# EAGLE design WifeOLED-v2 (EAGLE 6.5.0)
CNAME: An ESP8266 powered OLED display; CREVISION: v2; DESIGNER: Johan Kanflo
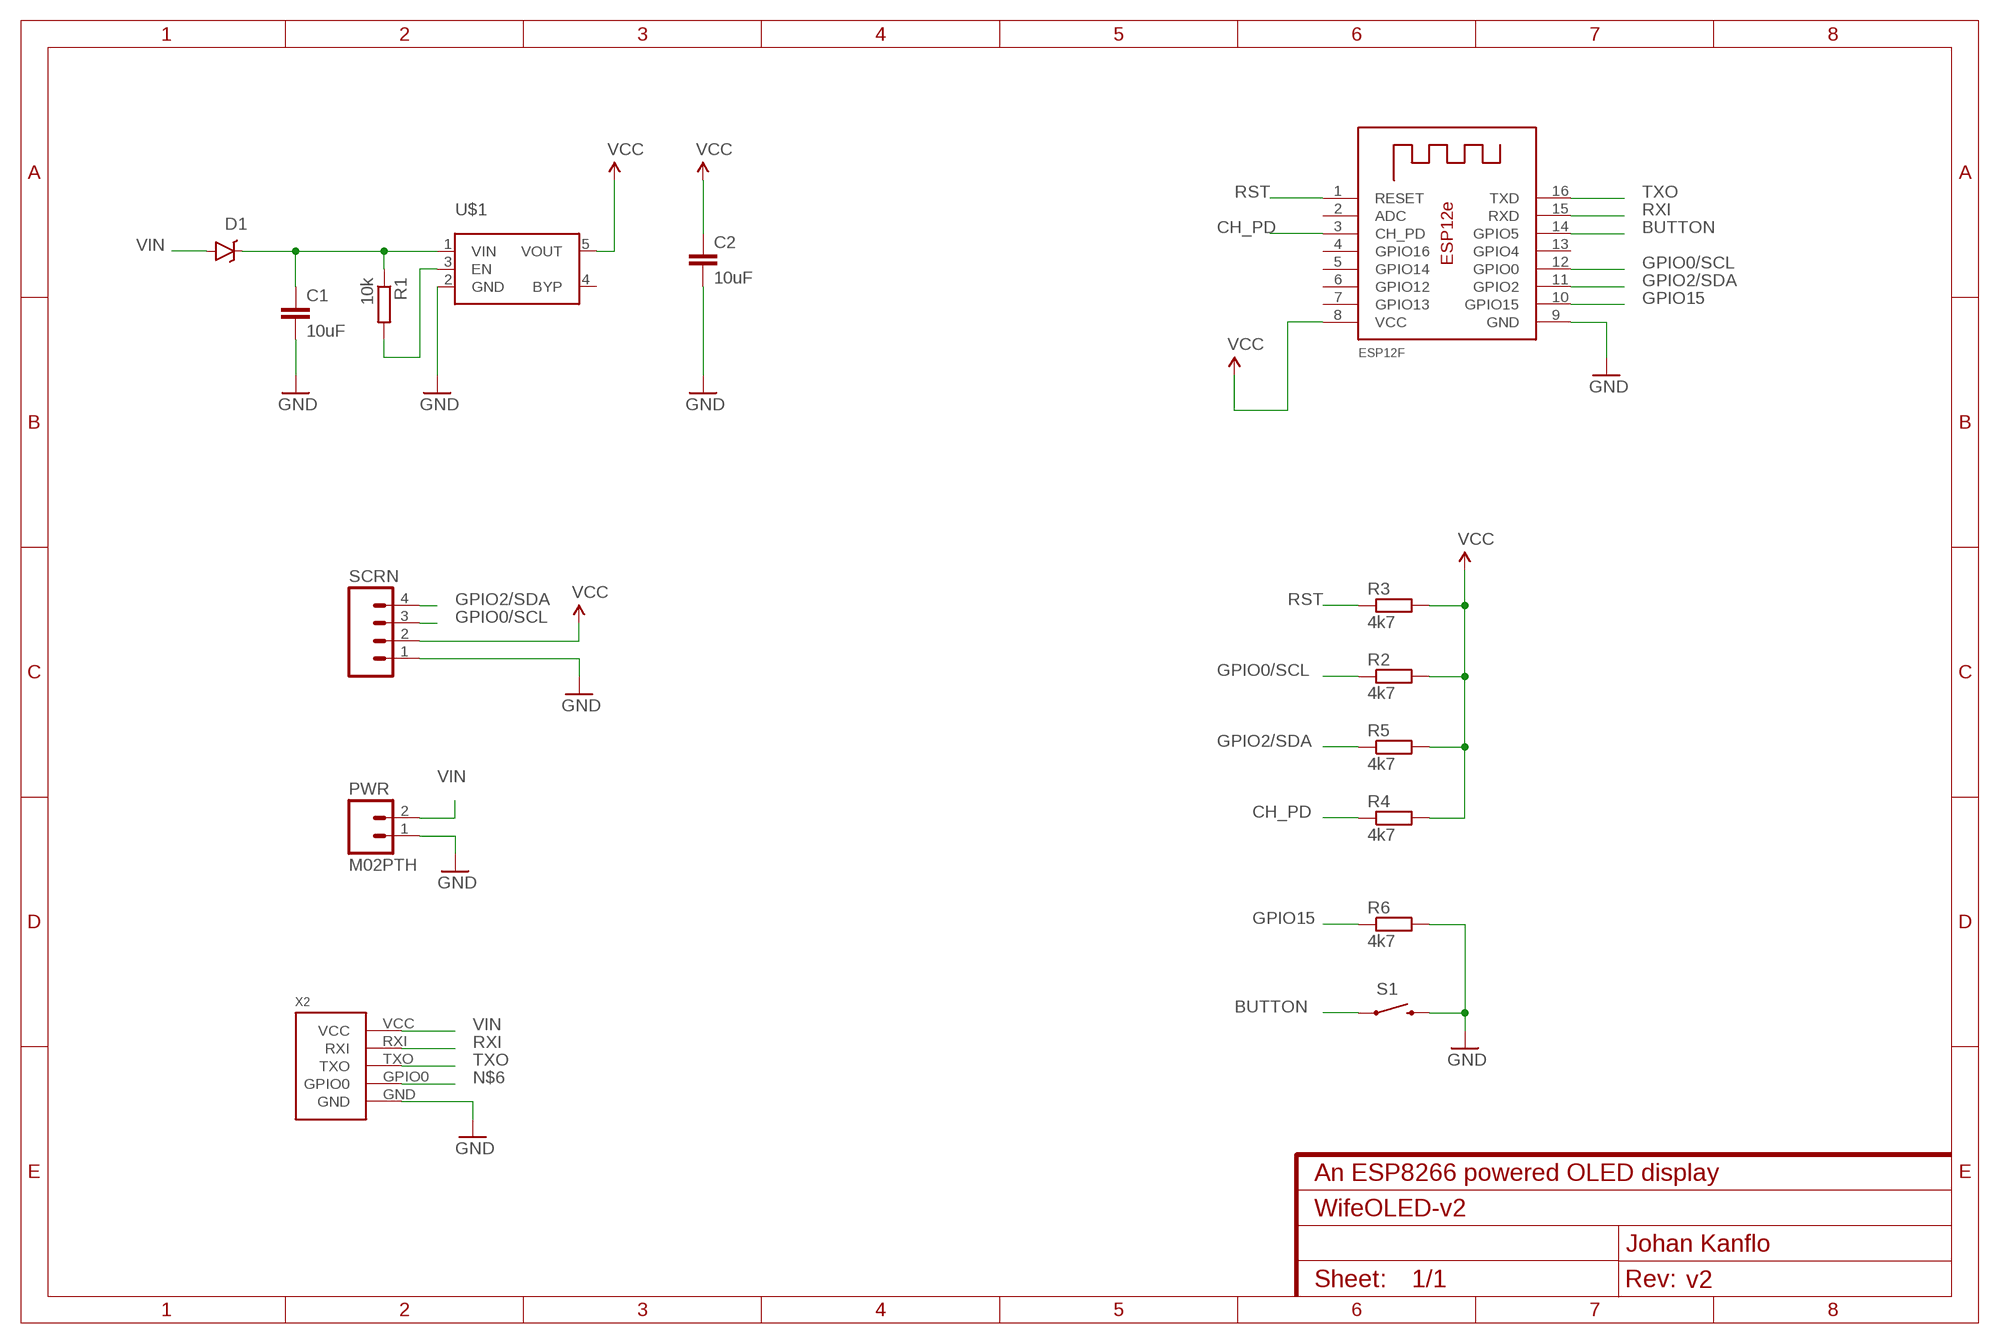
[diagram p0: schematic, sheet 1]

## Parts
C1  10uF  10UF-6.3V-20%(0603)  [0603-CAP]
C2  10uF  10UF-6.3V-20%(0603)  [0603-CAP]
D1  DIODE-SCHOTTKYSOD-123FL  [SOD-123FL]
ESP12F  ESP-12E  [ESP-12E]
PWR  M02PTH  [1X02]
R1  10k  R-EU_R0603  [R0603]
R2  4k7  R-EU_R0603  [R0603]
R3  4k7  R-EU_R0603  [R0603]
R4  4k7  R-EU_R0603  [R0603]
R5  4k7  R-EU_R0603  [R0603]
R6  4k7  R-EU_R0603  [R0603]
S1  SWITCH-MOMENTARY-2SMD-1101NE  [TACTILE-SWITCH-1101NE]
SCRN  M04PTH  [1X04]
U$1  SPX3819  [SOT23-5]
X2  ESPROGESPROG-DEVICE  [ESPROG]

## Nets
BUTTON: ESP12F.14(GPIO5) S1.1
CH_PD: ESP12F.3(CH_PD) R4.1
GND: C1.2 C2.2 ESP12F.9(GND) PWR.1 R6.2 S1.2 SCRN.1 U$1.2(GND) X2.GND
GPIO0/SCL: ESP12F.12(GPIO0) R2.1 SCRN.3
GPIO2/SDA: ESP12F.11(GPIO2) R5.1 SCRN.4
GPIO15: ESP12F.10(GPIO15) R6.1
N$1: R1.2 U$1.3(EN)
N$3: C1.1 D1.C R1.1 U$1.1(VIN)
N$6: X2.GPIO0
RST: ESP12F.1(RESET) R3.1
RXI: ESP12F.15(RXD) X2.RXI
TXO: ESP12F.16(TXD) X2.TXO
VCC: C2.1 ESP12F.8(VCC) R2.2 R3.2 R4.2 R5.2 SCRN.2 U$1.5(VOUT)
VIN: D1.A PWR.2 X2.VCC
Unconnected: ESP12F.2(ADC) ESP12F.4(GPIO16) ESP12F.5(GPIO14) ESP12F.6(GPIO12) ESP12F.7(GPIO13) ESP12F.13(GPIO4) U$1.4(BYP)

## Library data of the parts
C1 C2 = SparkFun-Capacitors:10UF-6.3V-20%(0603): CAP-11015; PROD_ID: CAP-11015
D1 = kanflo:DIODE-SCHOTTKY
ESP12F = kanflo:ESP-12E: ESP12e module This is a copy of AdaFruit's device with correct pin order for GPIO4 and GPIO5.
PWR = SparkFun-Connectors:M02: Standard 2-pin 0.1" header. Use with - straight break away headers ( PRT-00116) - right angle break away headers (PRT-00553) - swiss pins (PRT-00743) - machine pins (PRT-00117) - female headers (PRT-00115) Molex polarized connector foot print use with: PRT-08233 with associated crimp pins and housings. 2.54_SCREWTERM for use with PRT-10571. 3.5mm Screw Terminal footprints for PRT-08084 5mm Screw Terminal footprints for use with PRT-08433
R1-R6 = resistor:R-EU_: RESISTOR, European symbol
S1 = SparkFun-Electromechanical:SWITCH-MOMENTARY-2: Various NO switches- pushbuttons, reed, etc; PROD_ID: SWCH-00815
SCRN = SparkFun-Connectors:M04: Header 4 Standard 4-pin 0.1" header. Use with straight break away headers (SKU : PRT-00116), right angle break away headers (PRT-00553), swiss pins (PRT-00743), machine pins (PRT-00117), and female headers (PRT-00115). Molex polarized connector foot print use with SKU : PRT-08231 with associated crimp pins and housings. 1MM SMD Version SKU: PRT-10208
U$1 = kanflo:SPX3819: SPX3819 500mA LDO Voltage Regulator
X2 = kanflo:ESPROG

## Board
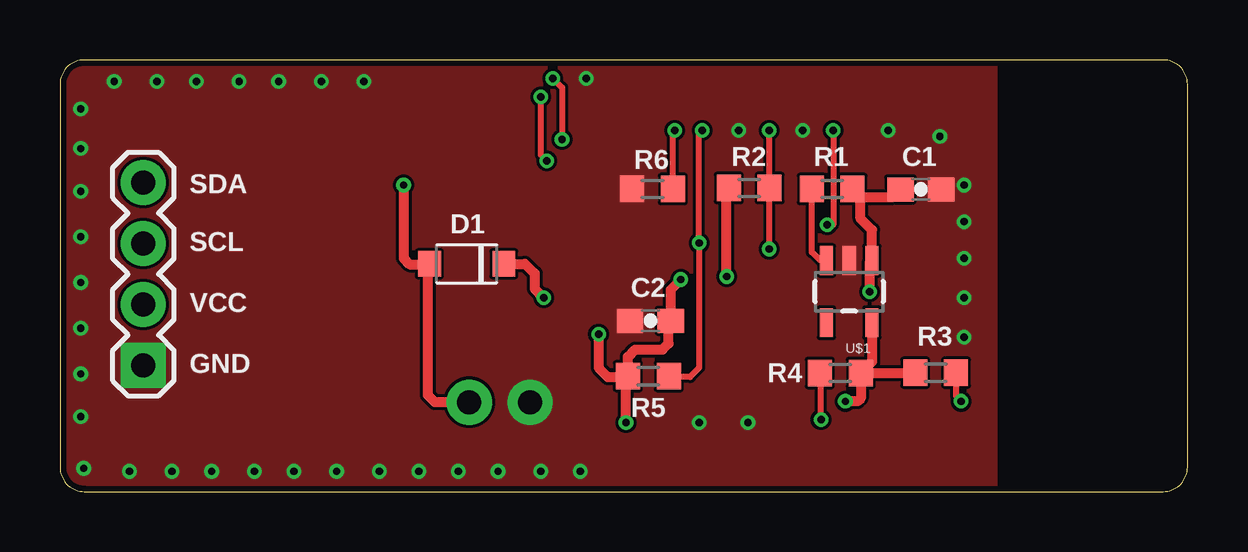
[diagram p1: board, top side]
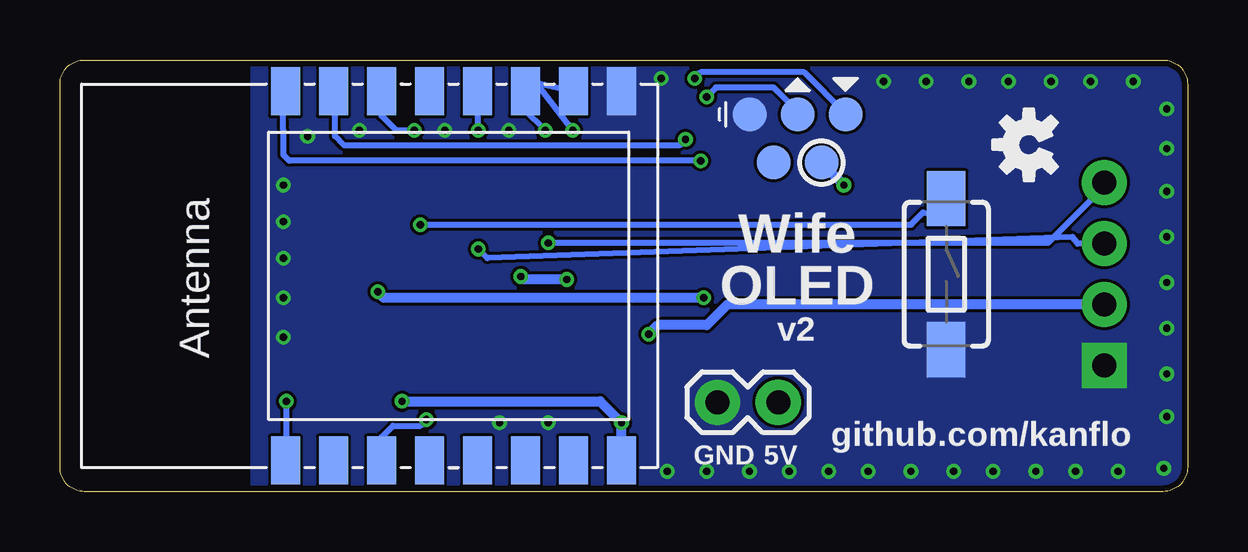
[diagram p2: board, bottom side, seen from below]

Size 47 x 18 mm. Coordinates in mm from the lower left corner, seen from the top.
Outline: 0,16.98 0,1.02 arc90 1.02,0 45.98,0 arc90 47,1.02 47,16.98 arc90 45.98,18 1.02,18 arc90 0,16.98
Copper layers (1*16): Top 0.035mm / dielectric 1.5mm / Bottom 0.035mm
Design rules "dirt_cheap_dirty_boards.v1": minimum track width 5mil, minimum drill 12mil, track to track 5mil, track to pad 5mil, pad to pad 5mil, via to via 5mil, smd to smd 0mil, copper to edge 10mil, drill to drill 10mil, minimum pad ring 10mil, minimum via ring 6mil, stop-mask expansion 2mil, vias tented up to drill 25mil, thermal gap 10mil

### Footprints (pad centres in the part's own frame; a part is rotated, then mirrored left to right if it is on the bottom)
0603-CAP = smd 1.1 x 1: 1 -0.85,0; 2 0.85,0
SOD-123FL = smd 0.95 x 1.05: A -1.6,0; C 1.5,0
ESP-12E = smd 2 x 1.2: 1 -7.7,4.5; 2 -7.7,2.5; 3 -7.7,0.5; 4 -7.7,-1.5; 5 -7.7,-3.5; 6 -7.7,-5.5; 7 -7.7,-7.5; 8 -7.7,-9.5; 9 7.7,-9.5; 10 7.7,-7.5; 11 7.7,-5.5; 12 7.7,-3.5; 13 7.7,-1.5; 14 7.7,0.5; 15 7.7,2.5; 16 7.7,4.5
1X02 = drill 1 pad 1.88: 1 0,0; 2 2.54,0
R0603 = smd 1 x 1.1: 1 -0.85,0; 2 0.85,0
TACTILE-SWITCH-1101NE = smd 2.3 x 1.6: 1 -3.15,0; 2 3.15,0
1X04 = drill 1 pad 1.88 square: 1 0,0 | drill 1 pad 1.88: 2 2.54,0; 3 5.08,0; 4 7.62,0
SOT23-5 = smd 0.55 x 1.2: 1 -0.95,-1.3; 2 0,-1.3; 3 0.95,-1.3; 4 0.95,1.3; 5 -0.95,1.3
ESPROG = smd 1.422 x 1.422: GND -1,-2; GPIO0 1,-1; RXI -1,2; TXO -1,0; VCC 1,1

### Placement (x,y rotation side)
C1  35.89,12.6 0 top
C2  24.61,7.12 180 top
D1  17,9.5 0 top
ESP12F  33.1,9 90 bottom
PWR  19.6,3.73 0 bottom
R1  32.19,12.62 180 top
R2  28.73,12.66 180 top
R3  36.5,4.96 180 top
R4  32.53,4.94 0 top
R5  24.53,4.81 180 top
R6  24.7,12.62 180 top
S1  10.06,9.06 270 bottom
SCRN  3.47,5.26 90 top
U$1  32.89,8.34 180 top
U$2  [OSHW-LOGO-S]  6.62,14.47 90 bottom
X2  16.26,14.72 270 bottom

### Tracks (layer width: path | path; a pad name or v marks a point on that pad's centre or on a via)
BUTTON  (via drill 0.3 pad 0.25)
  Top 0.254: v32.23,15.07 32.23,11.13 v31.98,11.13
  Bottom 0.254: ESP12F.14 33.6,15.67 32.99,15.07 v32.23,15.07 | v31.98,11.13 11.53,11.13 11.02,11.64 10.01,11.51 9.88,11.64 9.88,12.03 S1.1
CH_PD  (via drill 0.3 pad 0.25)
  Top 0.254: v31.72,3 31.72,4.89 R4.1
  Bottom 0.254: ESP12F.3 33.6,2.27 33.12,2.75 31.98,2.75 v31.72,3
GND  (via drill 0.3 pad 0.25)
  other vias: 12.67,17.1 10.89,17.1 9.12,17.1 7.47,17.1 5.69,17.1 4.04,17.1 2.26,17.1 0.86,15.96 0.86,14.3 0.86,12.53 0.86,3.13 0.86,4.91 0.86,6.81 0.86,8.72 0.86,10.62 13.31,0.84 11.53,0.84 9.75,0.84 8.1,0.84 6.32,0.84 4.67,0.84 2.89,0.84 0.99,0.97 14.96,0.84 16.61,0.84 18.26,0.84 20.04,0.84 21.69,0.84 21.94,17.23 37.69,12.78 37.69,11.26 37.69,9.73 37.69,8.08 37.69,6.43 26.64,2.88 28.68,2.88 36.68,14.81 34.52,15.07 30.96,15.07 28.29,15.07
  pour Top (rank 6, no thermals): -0.03,-0.05 -0.03,17.99 38.96,17.99 38.96,-0.05
  pour Bottom (rank 6, no thermals): -0.03,-0.05 -0.03,17.99 38.96,17.99 38.96,-0.05
GPIO0/SCL  (via drill 0.3 pad 0.25)
  Top 0.254: v29.56,15.07 29.58,15.05 R2.1 29.56,12.64 v29.56,10.11
  Bottom 0.254: v29.56,15.07 29.56,16.66 ESP12F.12 | SCRN.3 4.57,10.34 4.8,10.62 29.18,9.73 v29.56,10.11
GPIO2/SDA  (via drill 0.3 pad 0.25)
  Top 0.254: v26.77,15.07 26.64,14.94 v26.64,10.37 26.64,5.16 26.26,4.78 25.41,4.78 R5.1
  Bottom 0.254: SCRN.4 3.47,12.71 5.81,10.37 25.88,10.37 v26.64,10.37 | v26.77,15.07 27.66,15.96 27.66,16.64 ESP12F.11
GPIO15  (via drill 0.3 pad 0.25)
  Top 0.254: R6.1 25.55,14.99 v25.63,15.07
  Bottom 0.254: v25.63,15.07 27.15,17.05 ESP12F.10
N$1
  Top 0.254: U$1.3 31.69,9.64 31.34,9.99 R1.2
N$3  (via drill 0.3 pad 0.25)
  Top 0.406: D1.C 19.38,9.5 19.79,9.1 19.79,8.46 v20.17,8.08 | v33.76,8.34 33.76,9.55 U$1.1 33.84,10.91 33.37,11.38 33.37,12.29 | 33.37,12.29 R1.1 | 35.01,12.62 C1.1 34.72,12.29 33.37,12.29
  Bottom 0.406: v20.17,8.08 33.5,8.08 v33.76,8.34
RST  (via drill 0.3 pad 0.25)
  Top 0.254: R3.1 37.35,3.98 v37.57,3.76
  Bottom 0.254: v37.57,3.76 37.57,1.33 ESP12F.1
RXI  (via drill 0.3 pad 0.25)
  Top 0.254: v20.55,17.23 20.93,16.84 v20.93,14.69
  Bottom 0.254: X2.RXI 14.26,15.76 15.97,17.48 20.29,17.48 v20.55,17.23 | v20.93,14.69 21.18,14.43 35.15,14.43 35.53,14.81 35.53,16.63 ESP12F.15
TXO  (via drill 0.3 pad 0.25)
  Top 0.254: v20.04,16.46 20.04,14.05 v20.29,13.8
  Bottom 0.254: X2.TXO 16.26,15.86 17.25,16.84 19.66,16.84 v20.04,16.46 | v20.29,13.8 37.44,13.8 37.69,14.05 37.69,15.07 37.69,16.61 ESP12F.16
VCC  (via drill 0.3 pad 0.25)
  Top 0.406: U$1.5 33.84,5.41 R4.2 | R4.2 35.63,4.94 R3.2 | R4.2 33.38,3.89 33.25,3.76 v32.74,3.76 | v23.6,2.88 23.6,4.73 R5.2 | v22.45,6.56 22.45,5.16 22.83,4.78 23.64,4.78 R5.2 | R5.2 23.68,5.62 23.98,5.92 25.12,5.92 25.37,6.18 25.37,7.04 C2.1 25.46,8.42 v25.88,8.84 | v27.79,8.97 27.79,12.56 R2.2
  Bottom 0.406: ESP12F.8 v23.6,2.87 v23.6,2.88 24.48,3.76 v32.74,3.76 | SCRN.2 19.18,7.8 20.04,6.94 22.07,6.94 v22.45,6.56 | v25.88,8.84 27.66,8.84 v27.79,8.97
VIN  (via drill 0.3 pad 0.25)
  Top 0.406: v14.32,12.78 14.32,9.73 14.58,9.48 15.38,9.48 D1.A 15.34,9.44 15.34,4.02 15.63,3.73 PWR.2
  Bottom 0.406: X2.VCC v14.32,12.78

### Text on the board
tPlace: R6 | R2 | R1 | C1 | SDA | SCL | VCC | C2 | R3 | GND | R4 | R5
bPlace: Wife | OLED | v2 | github.com/kanflo | 5V | GND